# EAGLE schematic mk_bt (EAGLE 6.5.0)
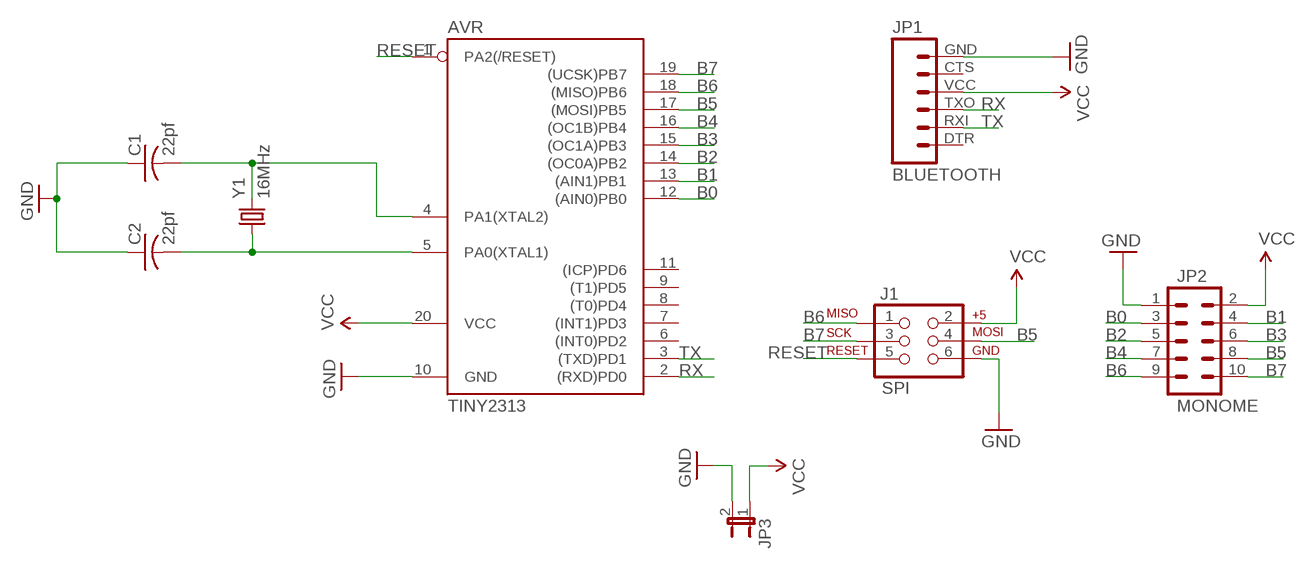
[diagram p0: schematic, sheet 1]

## Parts
AVR  TINY2313  TINY2313-*P*  [DIL20]
C1  22pf  C-US025-025X050  [C025-025X050]
C2  22pf  C-US025-025X050  [C025-025X050]
J1  SPI  AVR_SPI_PRG_6PTH  [2X3]
JP1  BLUETOOTH  FTDI_BASICPTH  [FTDI_BASIC]
JP2  MONOME  M05X2SHD  [2X5-SHROUDED]
JP3  JUMPER-2PTH  [1X02]
Y1  16MHz  CRYSTALHC49US  [HC49US]

## Nets
B0: AVR.12((AIN0)PB0) JP2.3
B1: AVR.13((AIN1)PB1) JP2.4
B2: AVR.14((OC0A)PB2) JP2.5
B3: AVR.15((OC1A)PB3) JP2.6
B4: AVR.16((OC1B)PB4) JP2.7
B5: AVR.17((MOSI)PB5) J1.4 JP2.8
B6: AVR.18((MISO)PB6) J1.1 JP2.9
B7: AVR.19((UCSK)PB7) J1.3 JP2.10
GND: AVR.10(GND) C1.1 C2.1 J1.6 JP1.GND JP2.1 JP3.2
N$1: AVR.5(PA0(XTAL1)) C2.2 Y1.1
N$2: AVR.4(PA1(XTAL2)) C1.2 Y1.2
RESET: AVR.1(PA2(/RESET)) J1.5
RX: AVR.2((RXD)PD0) JP1.TXO
TX: AVR.3((TXD)PD1) JP1.RXI
VCC: AVR.20(VCC) J1.2 JP1.VCC JP2.2 JP3.1
Unconnected: AVR.6((INT0)PD2) AVR.7((INT1)PD3) AVR.8((T0)PD4) AVR.9((T1)PD5) AVR.11((ICP)PD6) JP1.CTS JP1.DTR

## Library data of the parts
AVR = avr-7:TINY2313*: Atmel Tiny2313 2K Flash, 128 bytes EEPROM, 128 bytes RAM
C1 C2 = adafruit:C-US: CAPACITOR, American symbol
J1 = SparkFun:AVR_SPI_PRG_6: AVR ISP 6 Pin This is the reduced ISP connector for AVR programming. Common on Arduino. This footprint will take up less PCB space and can be used with a 10-pin to 6-pin adapter such as SKU: BOB-08508
JP1 = SparkFun:FTDI_BASIC: FTDI Basic: 3.3V and 5V
JP2 = SparkFun:M05X2: Header 5x2 Standard 10-pin dual row 0.1" header. Commonly used with AVR-ISP. Use with Spark Fun Electronics SKU: PRT-00778
JP3 = SparkFun:JUMPER-2: Jumper Basic 0.1" spaced jumper. Use with breakaway headers.
Y1 = SparkFun:CRYSTAL: Crystals Various standard crystals. Proven footprints. Spark Fun Electronics SKU : COM-00534